# EAGLE design PowerSupplySMD (EAGLE 9.6.2)
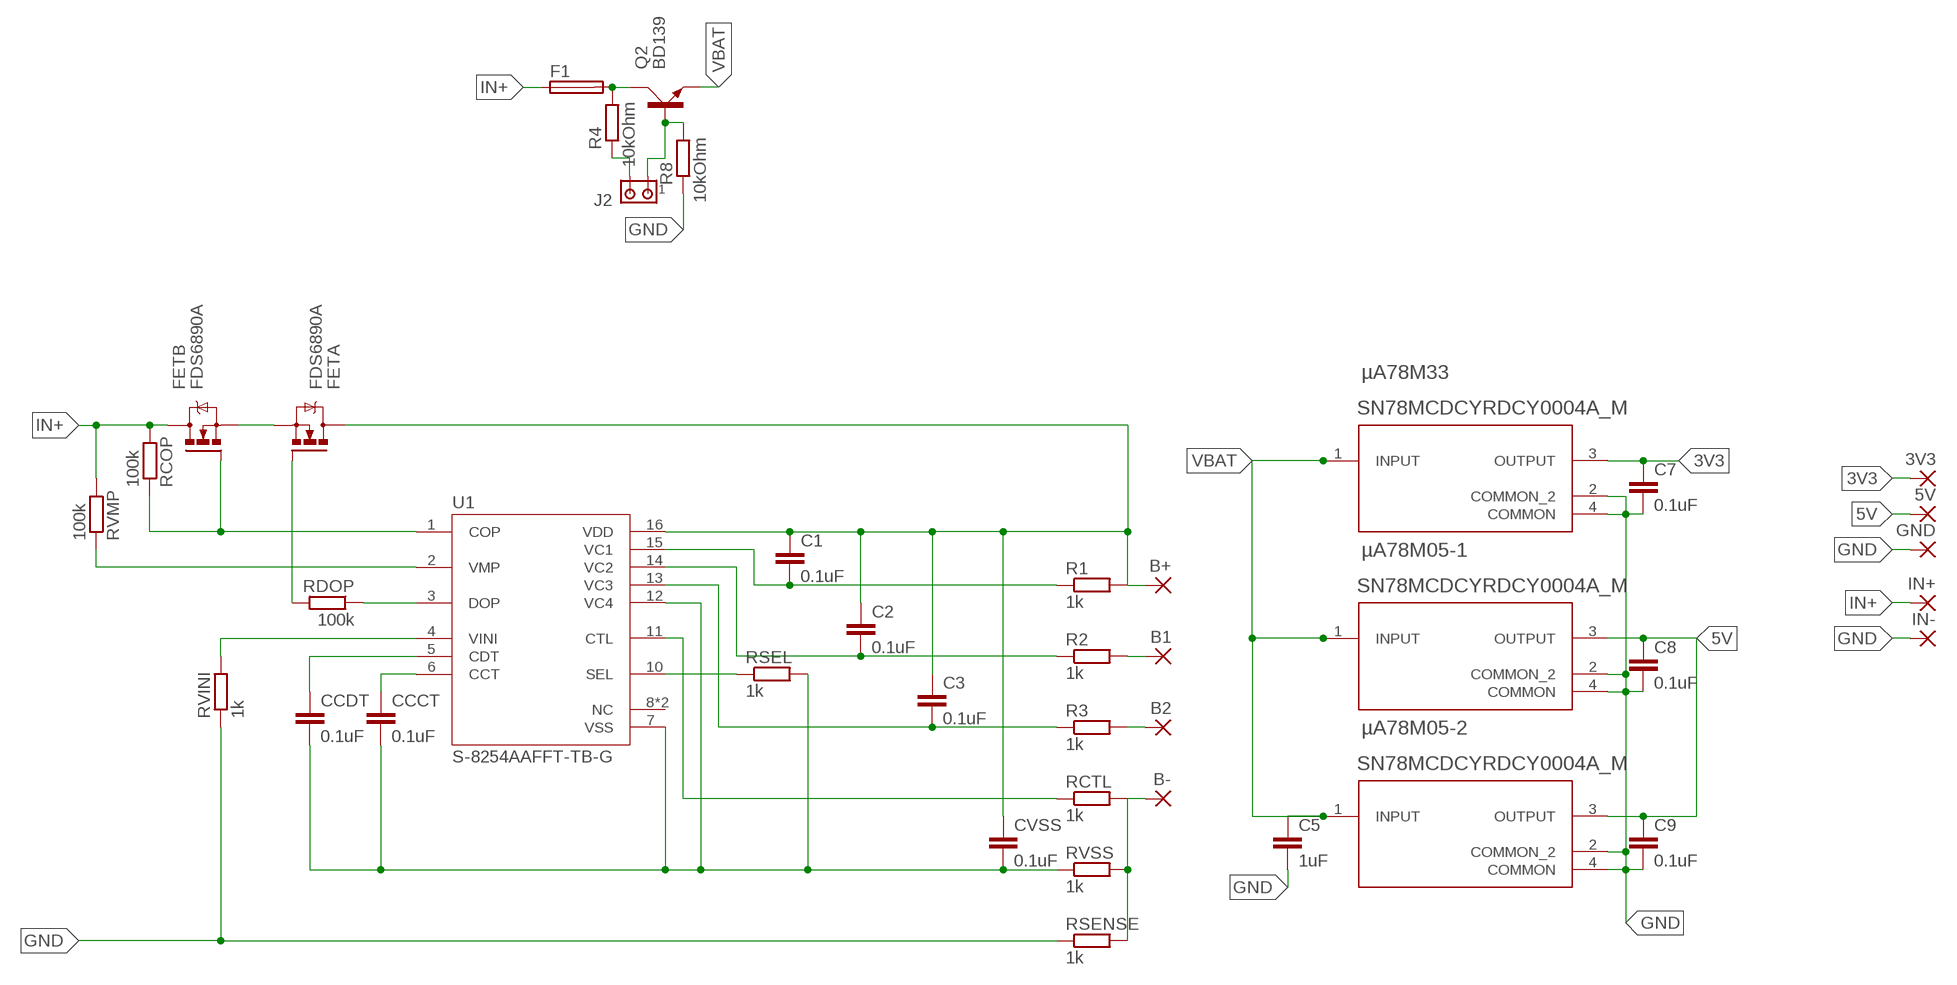
[diagram p0: schematic, sheet 1]

## Parts
3V3  SMD5  [SMD2,54-5,08]
5V  SMD5  [SMD2,54-5,08]
B1  SMD5  [SMD2,54-5,08]
B2  SMD5  [SMD2,54-5,08]
B+  SMD5  [SMD2,54-5,08]
B-  SMD5  [SMD2,54-5,08]
C1  0.1uF  C-EUC1206  [C1206]
C2  0.1uF  C-EUC1206  [C1206]
C3  0.1uF  C-EUC1206  [C1206]
C5  1uF  C-EUC1206  [C1206]
C7  0.1uF  C-EUC1206  [C1206]
C8  0.1uF  C-EUC1206  [C1206]
C9  0.1uF  C-EUC1206  [C1206]
CCCT  0.1uF  C-EUC1206  [C1206]
CCDT  0.1uF  C-EUC1206  [C1206]
CVSS  0.1uF  C-EUC1206  [C1206]
F1  FUSEBLANK_5X20MM  [FUSE_HOLDER_5X20MM]
FET  FDS6890A  [M08A]
GND  SMD5  [SMD2,54-5,08]
IN+  SMD5  [SMD2,54-5,08]
IN-  SMD5  [SMD2,54-5,08]
J2  MTA02-100  [10X02MTA]
Q2  BD139  [TO126AV]
R1  1k  R-EU_R1206  [R1206]
R2  1k  R-EU_R1206  [R1206]
R3  1k  R-EU_R1206  [R1206]
R4  10kOhm  R-EU_R1206  [R1206]
R8  10kOhm  R-EU_R1206  [R1206]
RCOP  100k  R-EU_R1206  [R1206]
RCTL  1k  R-EU_R1206  [R1206]
RDOP  100k  R-EU_R1206  [R1206]
RSEL  1k  R-EU_R1206  [R1206]
RSENSE  1k  R-EU_R1206  [R1206]
RVINI  1k  R-EU_R1206  [R1206]
RVMP  100k  R-EU_R1206  [R1206]
RVSS  1k  R-EU_R1206  [R1206]
U1  S-8254AAFFT-TB-G  [SOP65P640X110-16N]
µA78M05-1  SN78MCDCYRDCY0004A_M  [DCY0004A_M]
µA78M05-2  SN78MCDCYRDCY0004A_M  [DCY0004A_M]
µA78M33  SN78MCDCYRDCY0004A_M  [DCY0004A_M]

## Nets
3V3: 3V3.1(P) C7.1 µA78M33.3(OUTPUT)
5V: 5V.1(P) C8.1 C9.1 µA78M05-1.3(OUTPUT) µA78M05-2.3(OUTPUT)
B1: B1.1(P) R2.2
B2: B2.1(P) R3.2
B+: B+.1(P) C1.1 C2.1 C3.1 CVSS.1 FET.7(A:D) FET.8(A:D) R1.2 U1.16(VDD)
B-: B-.1(P) RCTL.2 RSENSE.2 RVSS.2
GND: C5.2 C7.2 C8.2 C9.2 GND.1(P) IN-.1(P) R8.1 RSENSE.1 RVINI.1 µA78M05-1.2(COMMON_2) µA78M05-1.4(COMMON) µA78M05-2.2(COMMON_2) µA78M05-2.4(COMMON) µA78M33.2(COMMON_2) µA78M33.4(COMMON)
IN+: F1.1 FET.5(B:D) FET.6(B:D) IN+.1(P) RCOP.2 RVMP.2
N$2: J2.2 R4.1
N$3: J2.1 Q2.B R8.2
N$5: RVMP.1 U1.2(VMP)
N$6: FET.4(B:G) RCOP.1 U1.1(COP)
N$7: FET.1(A:S) FET.3(B:S)
N$9: RDOP.1 U1.3(DOP)
N$10: FET.2(A:G) RDOP.2
N$11: F1.2 Q2.C R4.2
N$18: C1.2 R1.1 U1.15(VC1)
N$19: C2.2 R2.1 U1.14(VC2)
N$20: C3.2 R3.1 U1.13(VC3)
N$22: CCCT.2 CCDT.2 CVSS.2 RSEL.2 RVSS.1 U1.7(VSS) U1.12(VC4)
N$23: RCTL.1 U1.11(CTL)
N$25: RSEL.1 U1.10(SEL)
N$26: CCCT.1 U1.6(CCT)
N$27: CCDT.1 U1.5(CDT)
N$28: RVINI.2 U1.4(VINI)
VBAT: C5.1 Q2.E µA78M05-1.1(INPUT) µA78M05-2.1(INPUT) µA78M33.1(INPUT)
Unconnected: U1.8(NC) U1.9(NC)

## Library data of the parts
3V3 5V B1 B2 B+ B- GND IN+ IN- = wirepad:SMD5: SMD PAD
C1-C3 C5 C7-C9 CCCT CCDT CVSS = rcl:C-EU: CAPACITOR, European symbol; SPICEPREFIX: C
F1 = fuse:FUSE: Fuse; OC_FARNELL: unknown; OC_NEWARK: unknown
FET = transistor-power:FDS6890A: Dual N-Channel 2.5V Specified PowerTrenchTM MOSFET Source: FDS6890A.pdf
J2 = con-amp:MTA02-100: AMP connector
Q2 = transistor-power:BD139: NPN TRANSISTOR
R1-R4 R8 RCOP RCTL RDOP RSEL RSENSE RVINI RVMP RVSS = rcl:R-EU_: RESISTOR, European symbol; SPICEPREFIX: R
U1 = S-8254AAFFT-TB-G:S-8254AAFFT-TB-G: Battery Battery Protection IC Lithium Ion/Polymer 16-TSSOP Check availability <https://pricing.snapeda.com/parts/S-8254AAFFT-TB-G/Seiko/view-part?ref=eda>; AVAILABILITY: Not in stock; DESCRIPTION: Battery Battery Protection IC Lithium Ion/Polymer 16-TSSOP; MF: Seiko; MP: S-8254AAFFT-TB-G; PACKAGE: TSSOP-16 Seiko; PRICE: None
µA78M05-1 µA78M05-2 µA78M33 = LinearReg:SN78MCDCYR; COPYRIGHT: Copyright (C) 2023 Ultra Librarian. All rights reserved.; MANUFACTURER_PART_NUMBER: SN78MCDCYR; MFR_NAME: Texas Instruments; REFDES: RefDes; TYPE: TYPE

## Board
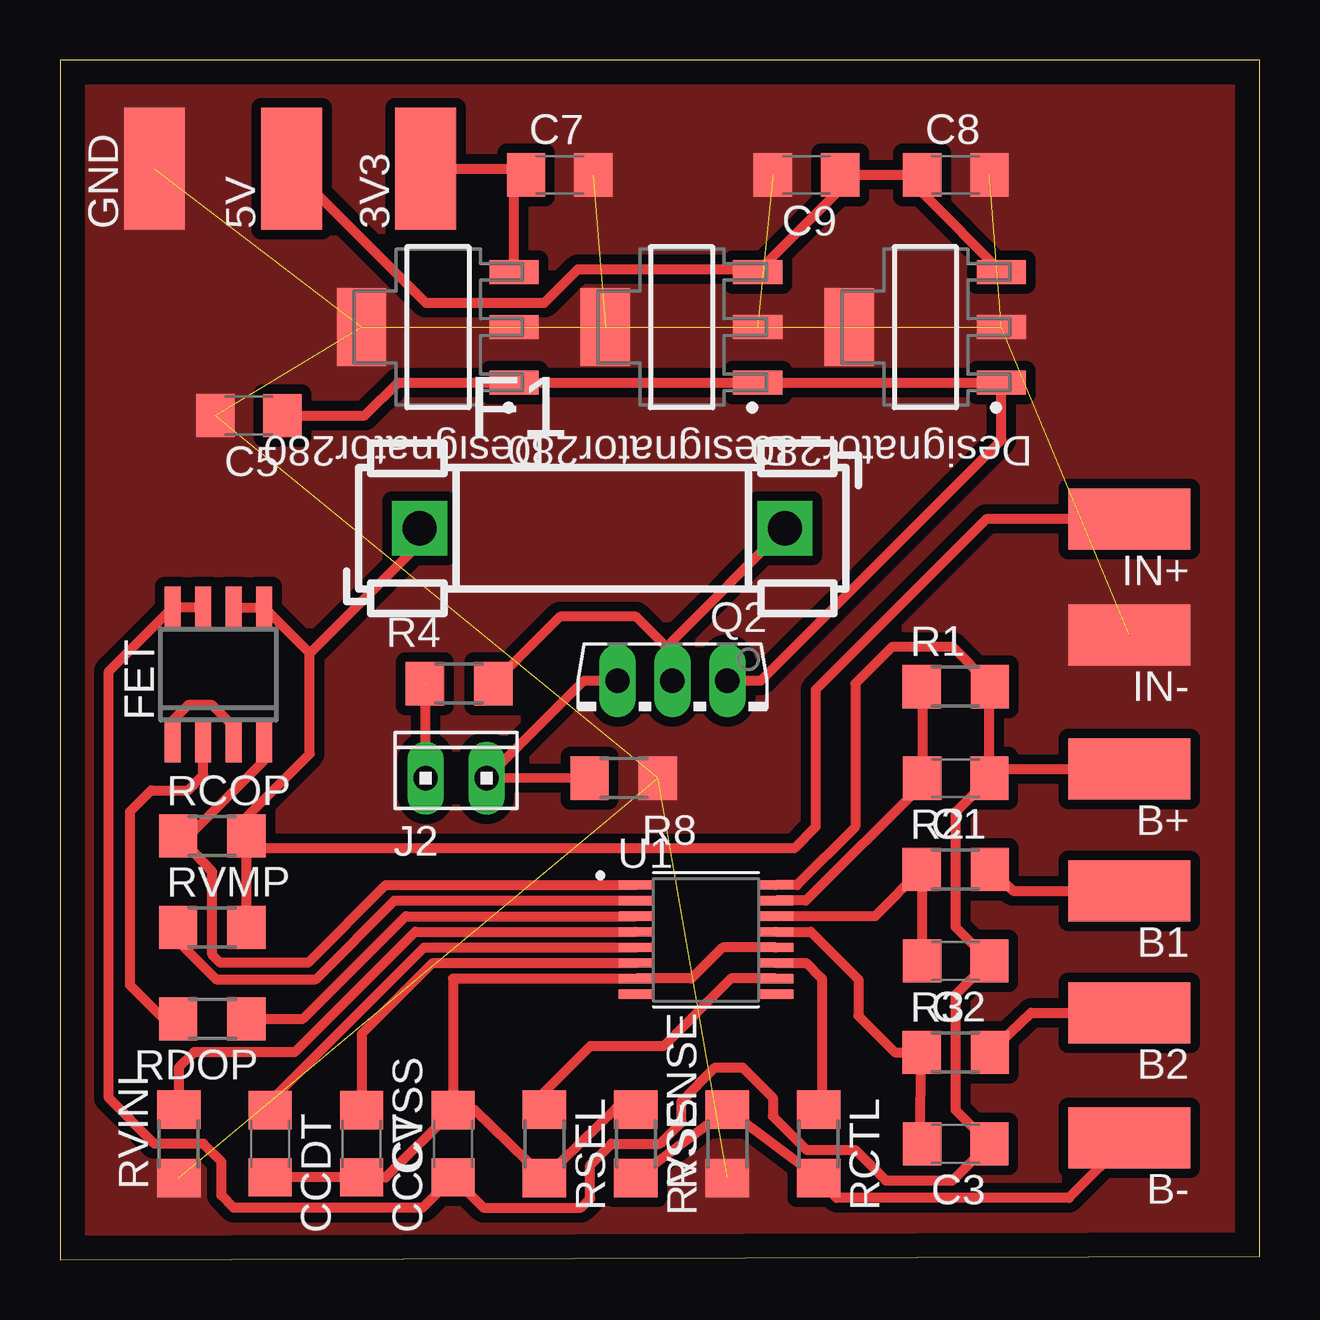
[diagram p1: board, top side]

Size 50 x 50 mm. Coordinates in mm from the lower left corner, seen from the top.
Outline: 0,0 50,0.13 50,50 0,50 0,0
Copper layers (1*16): Top 0.035mm / dielectric 1.5mm / Bottom 0.035mm
Design rules "default": minimum track width 6mil, minimum drill 0.35mm, track to track 6mil, track to pad 6mil, pad to pad 6mil, via to via 6mil, smd to smd 6mil, copper to edge 40mil, drill to drill 6mil, minimum pad ring 10mil, minimum via ring 8mil, stop-mask expansion 4mil, vias tented up to drill 0mil, thermal gap 10mil

### Footprints (pad centres in the part's own frame; a part is rotated, then mirrored left to right if it is on the bottom)
SMD2,54-5,08 = smd 2.54 x 5.08: 1 0,0
C1206 = smd 1.6 x 1.8: 1 -1.4,0; 2 1.4,0
FUSE_HOLDER_5X20MM = drill 1.422 pad 2.286 square: 1 0,0; 2 15.24,0
M08A = smd 0.65 x 1.75: 1 -1.905,-2.8; 2 -0.635,-2.8; 3 0.635,-2.8; 4 1.905,-2.8; 5 1.905,2.8; 6 0.635,2.8; 7 -0.635,2.8; 8 -1.905,2.8
10X02MTA = drill 1.016 long: 1 1.27,0; 2 -1.27,0
TO126AV = drill 1.016 long: B 2.286,-1.27; C 0,-1.27; E -2.286,-1.27
R1206 = smd 1.6 x 1.803: 1 -1.422,0; 2 1.422,0
SOP65P640X110-16N = smd 1.49 x 0.4: 1 -2.915,2.275; 2 -2.915,1.625; 3 -2.915,0.975; 4 -2.915,0.325; 5 -2.915,-0.325; 6 -2.915,-0.975; 7 -2.915,-1.625; 8 -2.915,-2.275; 9 2.915,-2.275; 10 2.915,-1.625; 11 2.915,-0.975; 12 2.915,-0.325; 13 2.915,0.325; 14 2.915,0.975; 15 2.915,1.625; 16 2.915,2.275
DCY0004A_M = smd 2.05 x 1: 1 -3.175,2.3; 2 -3.175,0; 3 -3.175,-2.3 | smd 2.05 x 3.25: 4 3.175,0

### Placement (x,y rotation side)
3V3  15.24,45.47 0 top
5V  9.65,45.47 0 top
B1  44.58,15.37 90 top
B2  44.58,10.29 90 top
B+  44.58,20.45 90 top
B-  44.58,5.08 90 top
C1  37.34,20.07 180 top
C2  37.34,12.45 180 top
C3  37.34,4.83 180 top
C5  7.87,35.18 180 top
C7  20.83,45.21 0 top
C8  37.34,45.21 0 top
C9  31.11,45.21 180 top
CCCT  12.57,4.83 270 top
CCDT  8.76,4.83 270 top
CVSS  16.38,4.83 90 top
F1  14.99,30.48 0 top
FET  6.6,24.38 0 top
GND  3.94,45.47 0 top
IN+  44.58,30.86 90 top
IN-  44.58,26.04 90 top
J2  16.51,20.07 0 top
Q2  25.53,22.86 180 top
R1  37.34,23.88 0 top
R2  37.34,16.26 0 top
R3  37.34,8.64 0 top
R4  16.64,24 0 top
R8  23.5,20.07 180 top
RCOP  6.35,17.65 0 top
RCTL  31.62,4.83 270 top
RDOP  6.35,10.03 180 top
RSEL  20.19,4.83 270 top
RSENSE  27.81,4.83 90 top
RVINI  4.95,4.83 90 top
RVMP  6.35,13.84 0 top
RVSS  24,4.83 270 top
U1  26.92,13.34 0 top
µA78M05-1  36.07,38.86 180 top
µA78M05-2  25.91,38.86 180 top
µA78M33  15.75,38.86 180 top

### Tracks (layer width: path | path; a pad name or v marks a point on that pad's centre or on a via)
3V3
  Top 0.406: µA78M33.3 18.92,44.71 C7.1 19.17,45.47 3V3.1
5V
  Top 0.406: µA78M05-1.3 35.94,44.47 C8.1 C9.1 32.52,44.59 µA78M05-2.3 28.97,41.27 21.59,41.27 20.19,39.88 15.24,39.88 5V.1
B1
  Top 0.406: R2.2 39.73,15.37 B1.1
B2
  Top 0.406: R3.2 40.49,10.29 B2.1
B+
  Top 0.406: FET.7 FET.8 2.03,24.52 2.03,6.73 3.94,4.83 5.97,4.83 6.73,4.06 6.73,2.67 7.24,2.16 15.12,2.16 CVSS.1 17.65,2.16 21.71,2.16 22.1,2.54 22.1,3.94 22.99,4.83 25,4.83 25.07,4.88 25.91,5.71 25.91,6.6 27.3,8 28.45,8 29.72,6.73 29.72,5.97 31.1,4.58 32.37,4.58 32.38,4.57 33.15,4.57 34.42,3.3 37.21,3.3 C3.1 37.34,6.23 37.34,11.05 C2.1 37.34,13.85 37.34,18.67 C1.1 | C1.1 38.74,23.78 | 38.74,23.78 R1.2 | 38.74,23.78 38.74,24 37.21,25.53 34.67,25.53 33.15,24 33.15,18.03 30.72,15.61 U1.16 | C1.1 39.12,20.45 B+.1
B-
  Top 0.406: RVSS.2 RSENSE.2 RCTL.2 32.38,2.56 42.06,2.56 B-.1
GND  (14 unrouted)
  pour Top (isolate 0.406, no thermals): 0.5,49.5 0.5,0.5 49.5,0.5 49.5,49.5
IN+
  Top 0.406: RVMP.2 RCOP.2 | FET.6 FET.5 10.1,25.59 10.41,25.28 | RCOP.2 7.77,18.44 10.41,21.08 10.41,25.28 | IN+.1 38.61,30.86 31.5,23.75 31.5,18.03 30.61,17.14 8.28,17.14 RCOP.2 | 10.41,25.28 10.42,25.28 14.99,29.84 F1.1
N$2  (1 unrouted)
  Top 0.406: J2.2 15.24,23.98
N$3
  Top 0.406: R8.2 17.8,20.04 J2.1 21.84,24.13 Q2.B
N$5
  Top 0.406: RVMP.1 4.87,13.32 6.5,11.68 10.67,11.68 13.94,14.96 U1.2
N$6
  Top 0.406: FET.4 8.51,20.8 5.36,17.65 RCOP.1 6.35,16.15 6.35,12.7 6.68,12.37 10.34,12.37 13.58,15.61 U1.1
N$7
  Top 0.406: FET.3 7.24,22.23 6.35,23.11 5.33,23.11 4.7,22.48 FET.1
N$9
  Top 0.406: RDOP.1 10.13,10.03 14.41,14.31 U1.3
N$10
  Top 0.406: RDOP.2 4.32,10.03 2.92,11.43 2.92,18.67 3.81,19.56 5.33,19.56 5.97,20.19 FET.2
N$11
  Top 0.406: R4.2 20.85,26.8 24,26.8 25.53,25.27 Q2.C 25.53,25.78 F1.2
N$18
  Top 0.406: R1.1 35.94,23.78 C1.2 35.94,19.81 31.09,14.96 U1.15
N$19
  Top 0.406: C2.2 35.94,16.16 R2.1 33.97,14.31 U1.14
N$20
  Top 0.406: C3.2 35.84,4.92 R3.1 34.8,8.64 33.27,10.16 33.27,11.68 31.3,13.66 U1.13
N$22
  Top 0.406: CVSS.2 16.38,11.71 U1.7 26.32,11.71 27.61,13.01 U1.12 | CVSS.2 13.58,3.43 CCCT.2 CCDT.2 | CVSS.2 17.29,6.23 RSEL.2 23.19,6.33 RVSS.1
N$23
  Top 0.406: U1.11 31.11,12.36 31.74,11.72 31.75,11.72 31.75,6.38 RCTL.1
N$25
  Top 0.406: RSEL.1 20.19,6.99 22.1,8.89 25.15,8.89 27.97,11.71 U1.10
N$26
  Top 0.406: CCCT.1 12.57,9.4 15.54,12.36 U1.6
N$27
  Top 0.406: CCDT.1 8.76,6.6 15.17,13.01 U1.5
N$28
  Top 0.406: RVINI.2 4.95,8 5.59,8.64 9.78,8.64 14.8,13.66 U1.4
VBAT
  Top 0.305: 18.68,36.56 µA78M33.1
  Top 0.406: Q2.E 29.21,24.13 39.24,34.16 µA78M05-1.1 µA78M05-2.1 µA78M33.1 14.09,36.56 12.7,35.18 C5.1